# EAGLE design 5v_converter (EAGLE 7.2.0)
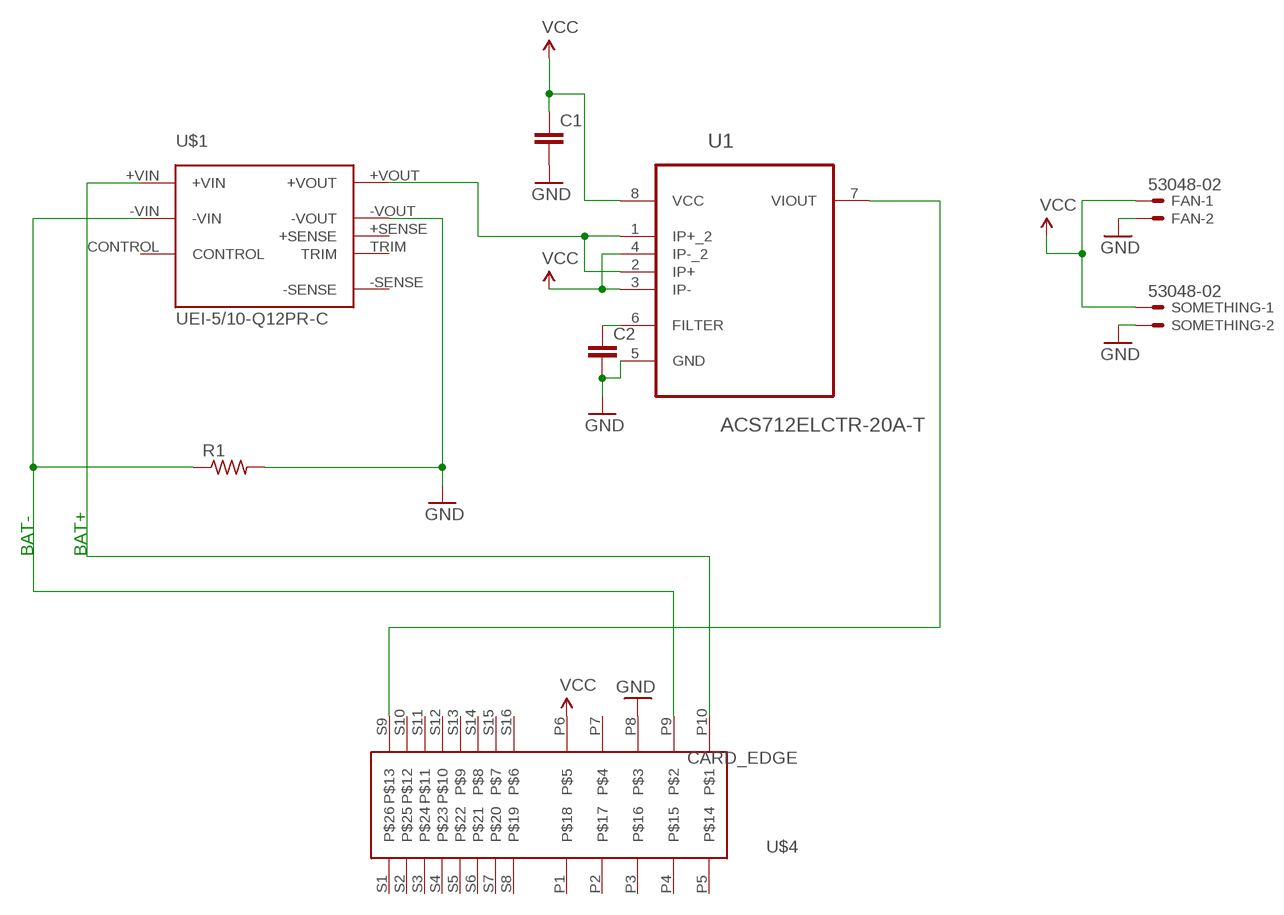
[diagram p0: schematic, sheet 1]

## Parts
C1  C-EU025-024X044  [C025-024X044]
C2  C-EU025-024X044  [C025-024X044]
FAN  53048-02  [53048-02]
R1  R-US_0204/2V  [0204V]
SOMETHING  53048-02  [53048-02]
U1  ACS712ELCTR-20A-T  [SOIC127P600X175-8N]
U$1  UEI-5/10-Q12PR-C  [UEI]
U$4  CARD_EDGE  [EDGE_CONNECTOR]

## Nets
GND: C1.2 C2.2 FAN.2 R1.2 SOMETHING.2 U1.5(GND) U$1.-VOUT U$4.P8
N$2: U$1.+VIN U$4.P10
N$3: R1.1 U$1.-VIN U$4.P9
N$4: U1.1(IP+_2) U1.2(IP+) U$1.+VOUT
N$5: U1.7(VIOUT) U$4.S9
N$7: C2.1 U1.6(FILTER)
VCC: C1.1 FAN.1 SOMETHING.1 U1.3(IP-) U1.4(IP-_2) U1.8(VCC) U$4.P6
Unconnected: U$1.+SENSE U$1.-SENSE U$1.CONTROL U$1.TRIM U$4.P1 U$4.P2 U$4.P3 U$4.P4 U$4.P5 U$4.P7 U$4.S1 U$4.S2 U$4.S3 U$4.S4 U$4.S5 U$4.S6 U$4.S7 U$4.S8 U$4.S10 U$4.S11 U$4.S12 U$4.S13 U$4.S14 U$4.S15 U$4.S16

## Notes on the sheet
- BAT- | BAT+

## Library data of the parts
C1 C2 = rcl:C-EU: CAPACITOR, European symbol
FAN SOMETHING = con-molex:53?-02: CONNECTOR wire to board 1.25 mm (.049 inch) pitch header; MF: MOLEX; MPN: 53048-0210; OC_FARNELL: 1012259; OC_NEWARK: 57H4718
R1 = resistor:R-US_: RESISTOR, American symbol
U1 = Allegro_By_element14_Batch_1:ACS712ELCTR-20A-T: Linear Current Sensor; MPN: ACS712ELCTR-20A-T; OC_FARNELL: 1329624; OC_NEWARK: 31M3133; PACKAGE: SOIC-8; SUPPLIER: Allegro
U$1 = CINCON DC-DC CONVERTER:UEI-5/10-Q12PR-C
U$4 = Molex_Edge:CARD_EDGE

## Board
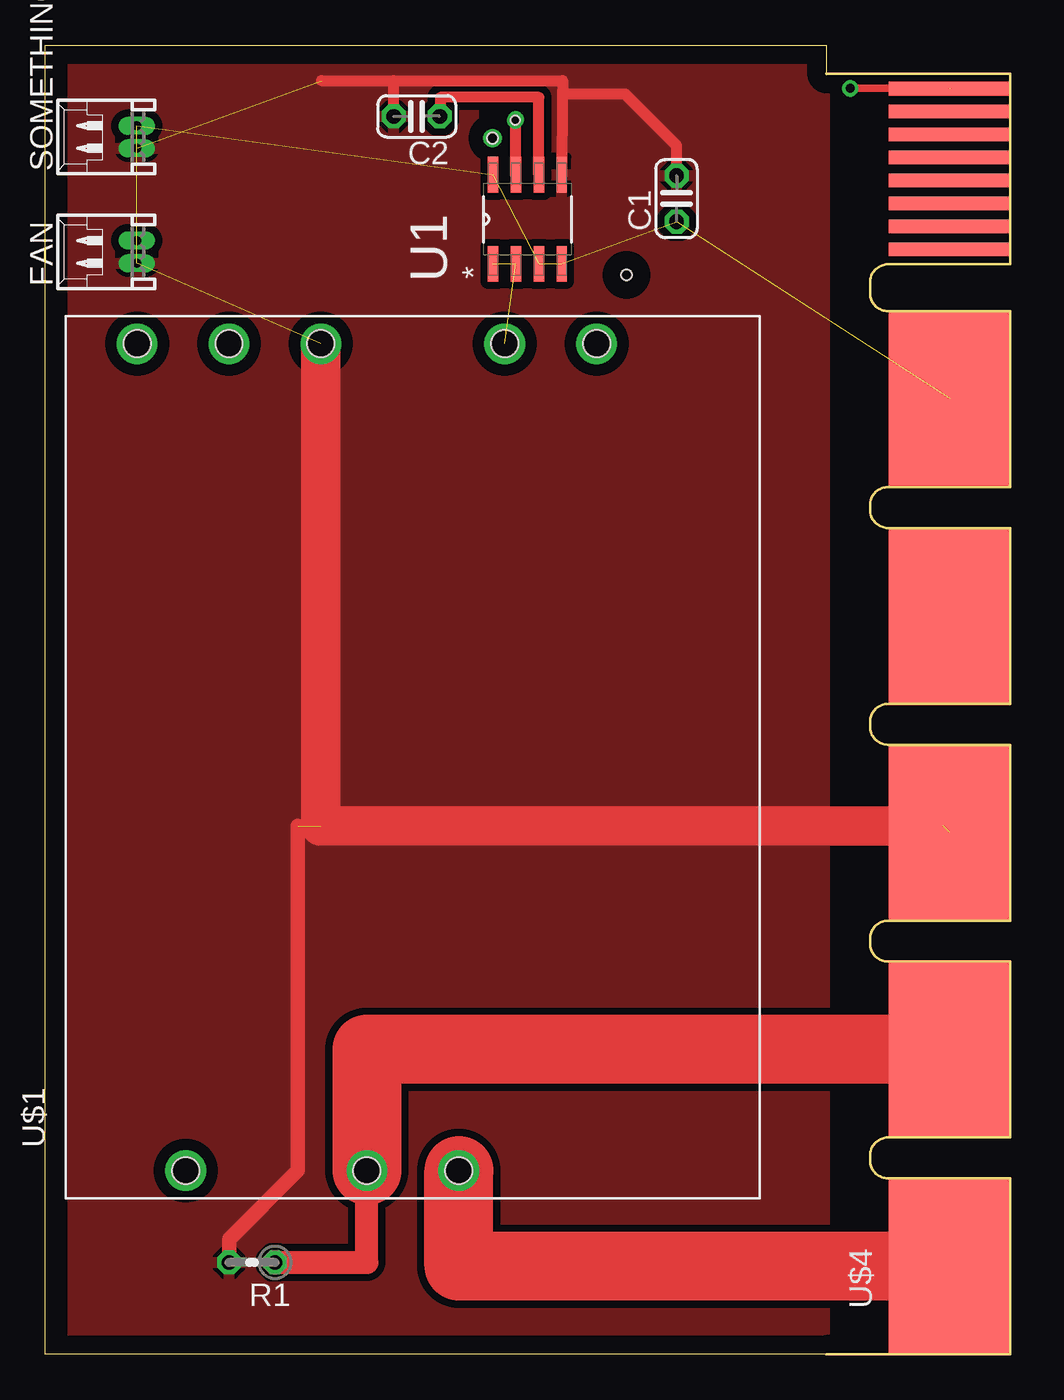
[diagram p1: board, top side]
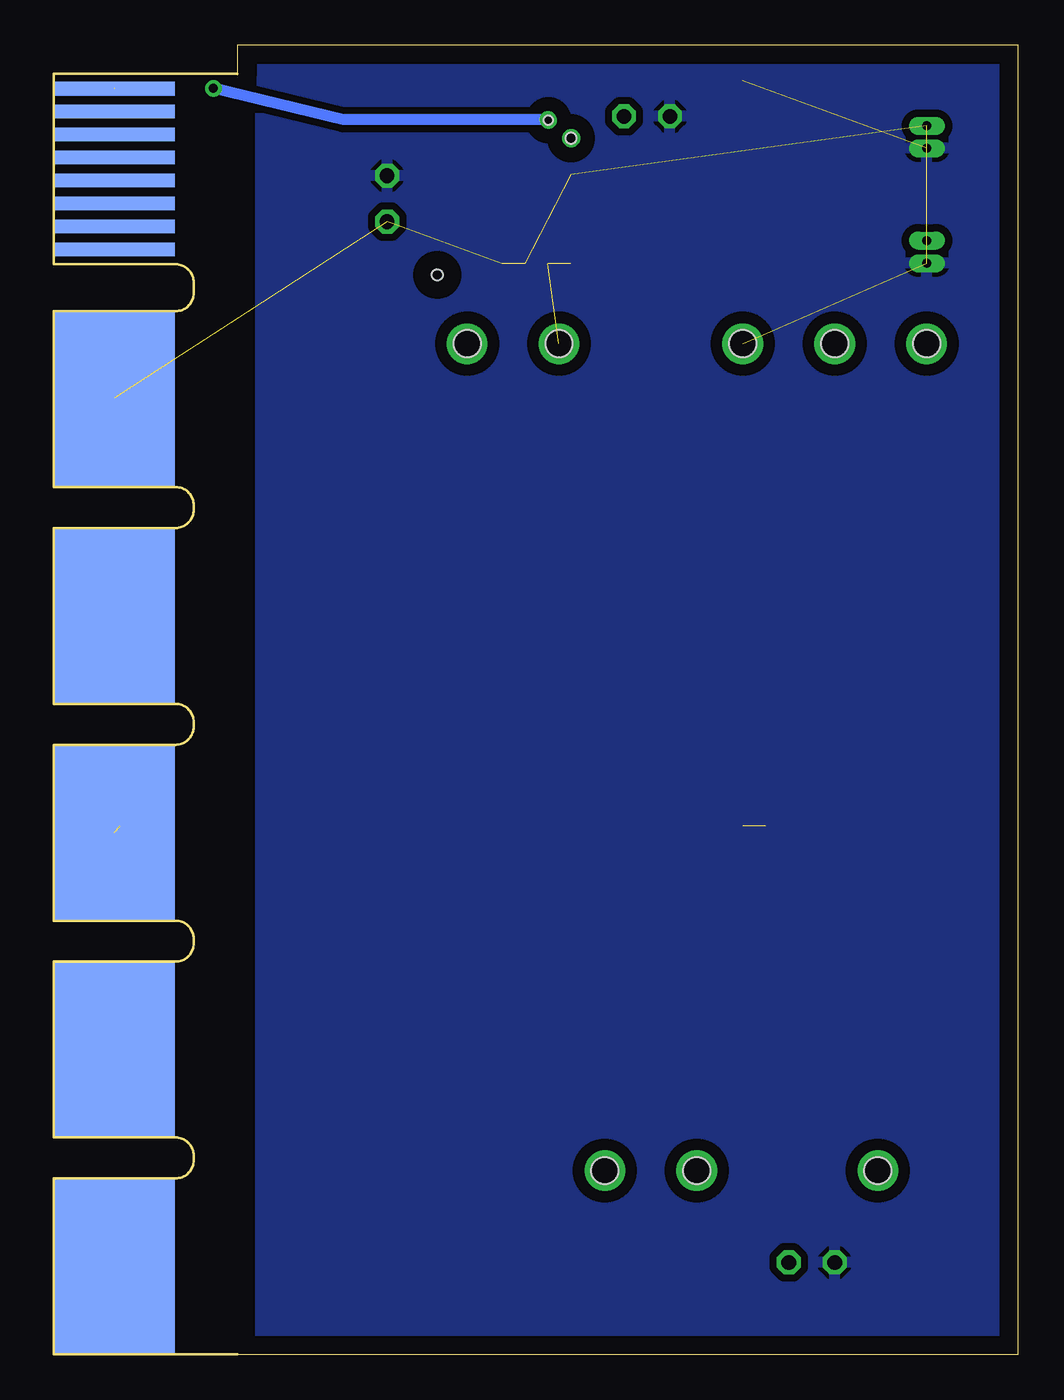
[diagram p2: board, bottom side, seen from below]

Size 53.34 x 72.39 mm. Coordinates in mm from the lower left corner, seen from the top.
Outline: 43.18,0 0,0 0,72.39 43.18,72.39 43.18,70.74
Copper layers (1*16): Top 0.035mm / dielectric 1.5mm / Bottom 0.035mm
Design rules "default": minimum track width 10mil, minimum drill 24mil, track to track 8mil, track to pad 8mil, pad to pad 8mil, via to via 8mil, smd to smd 8mil, copper to edge 40mil, drill to drill 8mil, minimum pad ring 10mil, minimum via ring 8mil, stop-mask expansion 4mil, vias tented up to drill 0mil, thermal gap 10mil
Holes 0.6 mm at 32.13,59.69 24.73,67.25
Holes 0.5 mm at 25.98,68.24

### Footprints (pad centres in the part's own frame; a part is rotated, then mirrored left to right if it is on the bottom)
C025-024X044 = drill 0.813 octagon: 1 -1.27,0; 2 1.27,0
53048-02 = drill 0.5 pad 0.698 long: 1 0.625,-1.25; 2 -0.625,-1.25
0204V = drill 0.813 octagon: 1 -1.27,0; 2 1.27,0
SOIC127P600X175-8N = smd 1.981 x 0.559: 1 -2.464,1.905; 2 -2.464,0.635; 3 -2.464,-0.635; 4 -2.464,-1.905; 5 2.464,-1.905; 6 2.464,-0.635; 7 2.464,0.635; 8 2.464,1.905
UEI = drill 1.5: +SENSE 22.86,-10.16; +VIN -22.86,-2.54; +VOUT 22.86,-5.08; -SENSE 22.86,10.16; -VIN -22.86,2.54; -VOUT 22.86,5.08; CONTROL -22.86,12.548; TRIM 22.86,15.24 | hole 1.5: -22.86,-2.54; -22.86,2.54; -22.86,12.548; 22.86,-10.16; 22.86,-5.08; 22.86,5.08; 22.86,10.16; 22.86,15.24
EDGE_CONNECTOR = smd 9.728 x 6.706 bottom: P1 52.87,3.35; P2 40.87,3.35; P3 28.87,3.35; P4 16.87,3.35 | smd 9.73 x 6.7 bottom: P5 4.87,3.35 | smd 9.728 x 6.706: P6 52.87,3.35; P7 40.87,3.35; P8 28.87,3.35; P9 16.87,3.35 | smd 9.73 x 6.7: P10 4.87,3.35 | smd 0.76 x 6.7 bottom: S1 69.99,3.35; S2 68.72,3.35; S3 67.45,3.35; S4 66.18,3.35; S5 64.91,3.35; S6 63.64,3.35; S7 62.37,3.35; S8 61.1,3.35 | smd 0.76 x 6.7: S9 69.99,3.35; S10 68.72,3.35; S11 67.45,3.35; S12 66.18,3.35; S13 64.91,3.35; S14 63.64,3.35; S15 62.37,3.35; S16 61.1,3.35

### Placement (x,y rotation side)
C1  34.9,63.91 90 top
C2  20.54,68.45 180 top
FAN  3.81,60.96 90 top
R1  11.43,5.08 180 top
SOMETHING  3.81,67.31 90 top
U1  26.66,62.76 90 top
U$1  20.32,33.02 90 top
U$4  53.34,0 90 top

### Tracks (layer width: path | path; a pad name or v marks a point on that pad's centre or on a via)
GND  (5 unrouted)
  Top 0.61: 15.28,70.43 19.27,70.43 | 19.27,70.43 28.6,70.43 28.59,69.45 | 28.59,69.45 U1.5 | C2.2 19.27,70.43 | C1.2 34.9,66.84 32.06,69.69 28.83,69.69 28.59,69.45
  Top 0.813: R1.2 10.16,6.35 13.97,10.16 13.97,29.21
  Top 2.184: U$1.-VOUT 15.24,29.21 49.65,29.21
  pour Top (isolate 0.406): 43.07,0.1 1.55,0.1 1.55,72.05 43.07,72.05
  pour Bottom (isolate 0.406): 1.27,71.12 41.91,71.12 41.91,0 1.27,0
N$2
  Top 3.81: U$4.P10 22.86,4.87 U$1.+VIN
N$3
  Top 1.27: R1.1 17.78,5.08 U$1.-VIN
  Top 3.81: U$4.P9 17.78,16.87 U$1.-VIN
N$4  (2 unrouted)
N$5  (via drill 0.5)  (1 unrouted)
  Top 0.406: v44.5,70 49.99,70
  Top 0.61: U1.7 v26.01,68.28
  Bottom 0.61: v26.01,68.28 37.34,68.28 v44.5,70
N$6  (via drill 0.6)
  other vias: 24.73,67.25
N$7
  Top 0.61: U1.6 27.29,69.51 21.84,69.51 21.84,68.45 C2.1
N$9  (via drill 0.5)
  other vias: 25.98,68.24
VCC  (6 unrouted)